# EAGLE design Adafruit 50pin to 40pin TFT with AR1100 Adapter (EAGLE 6.3)
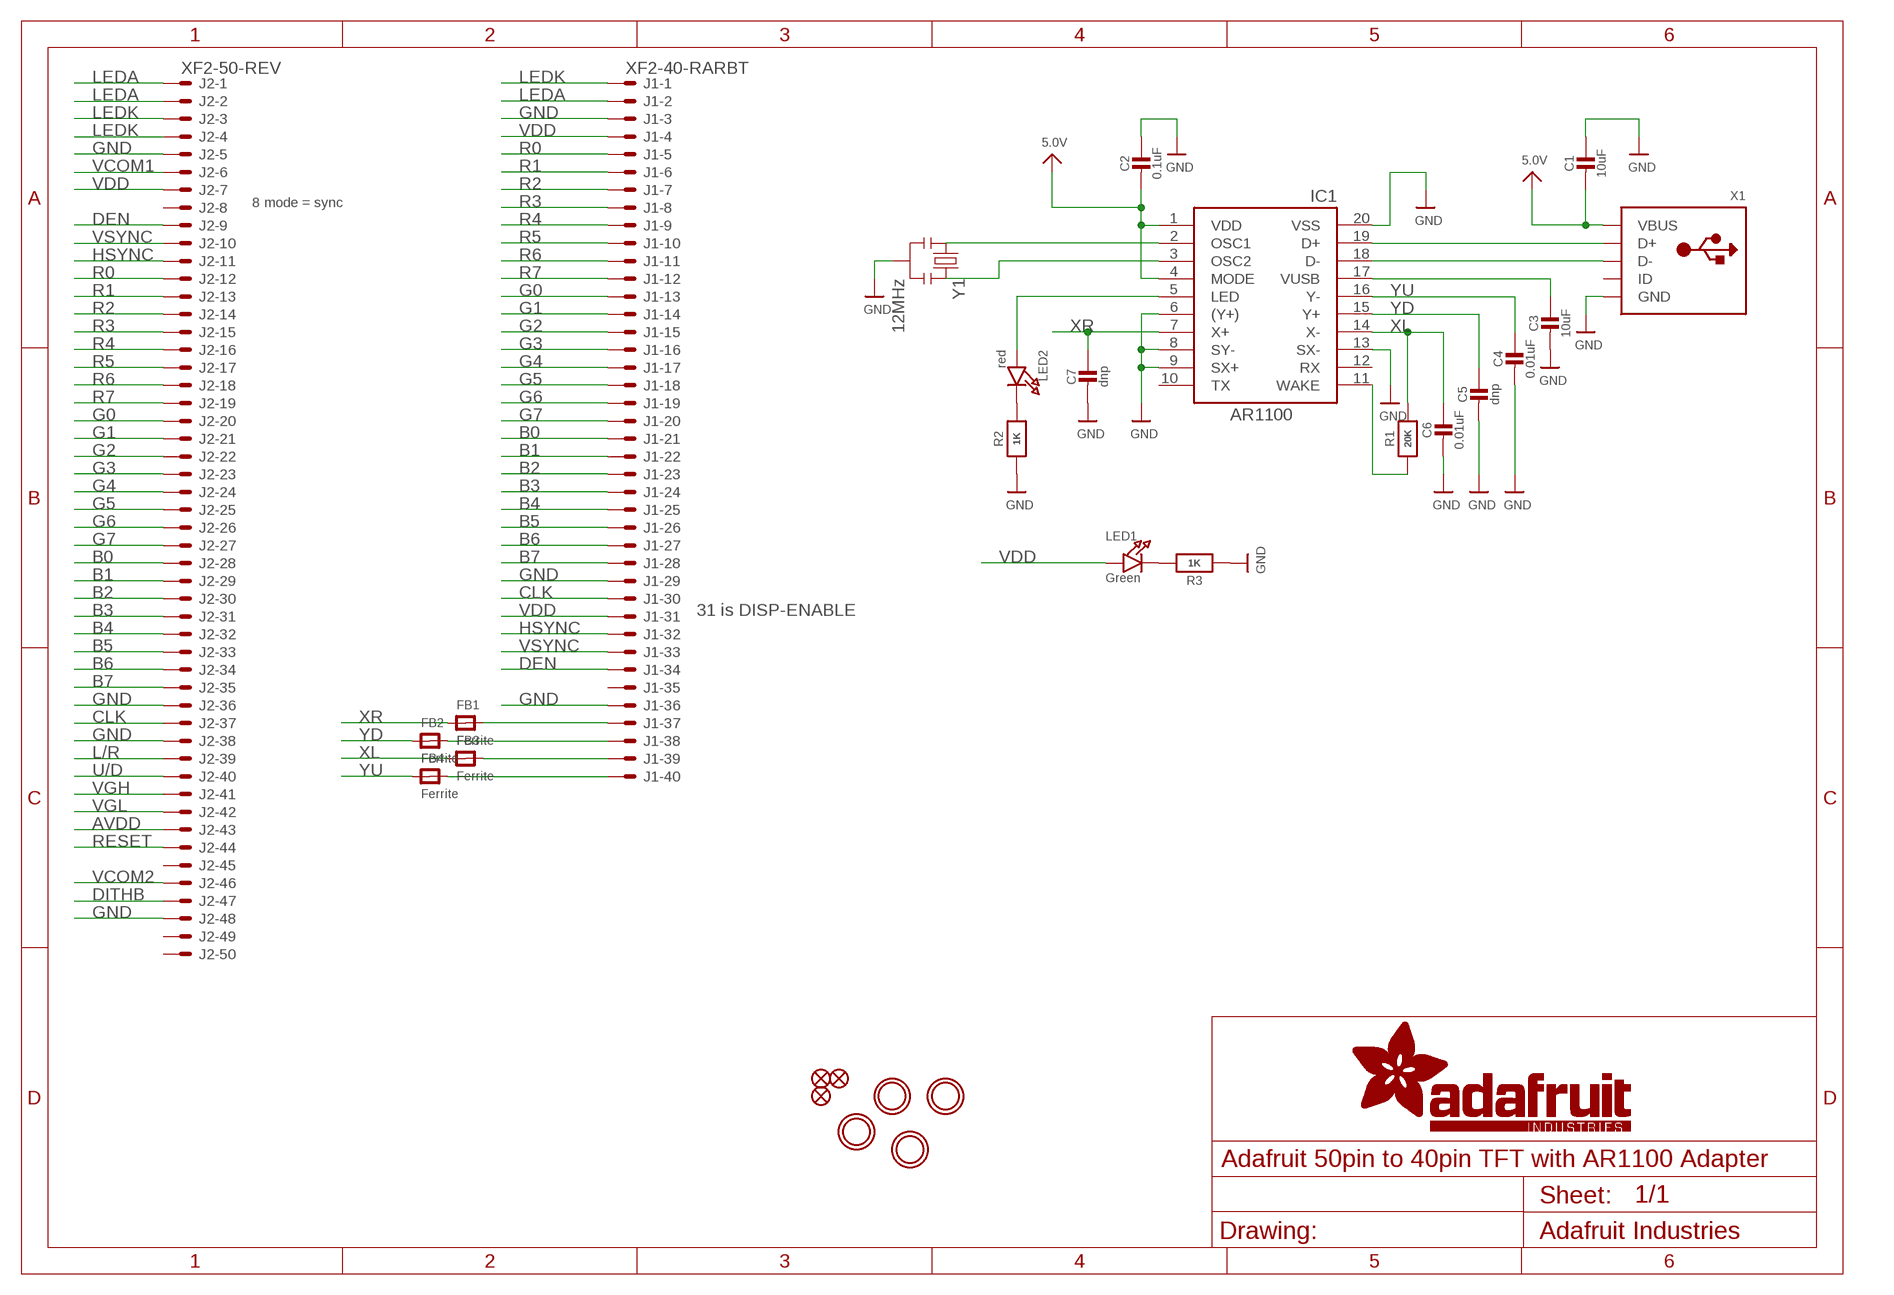
[diagram p0: schematic, sheet 1]

## Parts
C1  10uF  CAP_CERAMIC_0805MP  [_0805MP]
C2  0.1uF  CAP_CERAMIC_0805MP  [_0805MP]
C3  10uF  CAP_CERAMIC_0805MP  [_0805MP]
C4  0.01uF  CAP_CERAMIC_0805MP  [_0805MP]
C5  dnp  CAP_CERAMIC_0805MP  [_0805MP]
C6  0.01uF  CAP_CERAMIC_0805MP  [_0805MP]
C7  dnp  CAP_CERAMIC_0805MP  [_0805MP]
FB1  Ferrite  FERRITE_0805  [_0805]
FB2  Ferrite  FERRITE_0805  [_0805]
FB3  Ferrite  FERRITE_0805  [_0805]
FB4  Ferrite  FERRITE_0805  [_0805]
FID1  FIDUCIAL""  [FIDUCIAL_1MM]
FID2  FIDUCIAL""  [FIDUCIAL_1MM]
FID3  FIDUCIAL""  [FIDUCIAL_1MM]
IC1  AR1100_SSOP  [TSSOP20-5.3MMBODY]
J1  XF2-40-RARBT  [4-1734839-0]
J2  XF2-50-REV  [5-1734839-0-REV]
LED1  Green  LED0805_NOOUTLINE  [CHIPLED_0805_NOOUTLINE]
LED2  red  LED0805_NOOUTLINE  [CHIPLED_0805_NOOUTLINE]
R1  20K  RESISTOR_0805MP  [_0805MP]
R2  1K  RESISTOR_0805MP  [_0805MP]
R3  1K  RESISTOR_0805MP  [_0805MP]
U$11  MOUNTINGHOLE2.5  [MOUNTINGHOLE_2.5_PLATED]
U$14  MOUNTINGHOLE2.5  [MOUNTINGHOLE_2.5_PLATED]
U$15  MOUNTINGHOLE2.5  [MOUNTINGHOLE_2.5_PLATED]
U$16  MOUNTINGHOLE2.5  [MOUNTINGHOLE_2.5_PLATED]
X1  USBMINIBLARGE  [USB-MINIB_LARGER]
Y1  12MHz  RESONATORSMD  [RESONATOR-SMD]

## Nets
5.0V: C1.2 C2.2 IC1.1(VDD) IC1.4(MODE) X1.VBUS
AVDD: J2.43
B0: J1.21 J2.28
B1: J1.22 J2.29
B2: J1.23 J2.30
B3: J1.24 J2.31
B4: J1.25 J2.32
B5: J1.26 J2.33
B6: J1.27 J2.34
B7: J1.28 J2.35
CLK: J1.30 J2.37
D+: IC1.19(D+) X1.D+
D-: IC1.18(D-) X1.D-
DEN: J1.34 J2.9
DITHB: J2.47
G0: J1.13 J2.20
G1: J1.14 J2.21
G2: J1.15 J2.22
G3: J1.16 J2.23
G4: J1.17 J2.24
G5: J1.18 J2.25
G6: J1.19 J2.26
G7: J1.20 J2.27
GND: C1.1 C2.1 C3.2 C4.2 C5.2 C6.2 C7.2 IC1.6((Y+)) IC1.8(SY-) IC1.9(SX+) IC1.13(SX-) IC1.20(VSS) J1.3 J1.29 J1.36 J2.5 J2.36 J2.38 J2.48 R2.1 R3.1 X1.GND X1.GND1(GND) X1.GND2(GND) X1.GND3(GND) X1.GND4(GND) Y1.2
HSYNC: J1.32 J2.11
L/R: J2.39
LEDA: J1.2 J2.1 J2.2
LEDK: J1.1 J2.3 J2.4
N$1: IC1.2(OSC1) Y1.1
N$2: IC1.3(OSC2) Y1.3
N$3: FB1.2 J1.37
N$4: FB2.2 J1.38
N$5: FB3.2 J1.39
N$6: FB4.2 J1.40
N$7: LED2.C R2.2
N$8: IC1.5(LED) LED2.A
N$9: IC1.11(WAKE) R1.1
N$10: LED1.C R3.2
N$13: C3.1 IC1.17(VUSB)
R0: J1.5 J2.12
R1: J1.6 J2.13
R2: J1.7 J2.14
R3: J1.8 J2.15
R4: J1.9 J2.16
R5: J1.10 J2.17
R6: J1.11 J2.18
R7: J1.12 J2.19
RESET: J2.44
U/D: J2.40
VCOM1: J2.6
VCOM2: J2.46
VDD: J1.4 J1.31 J2.7 LED1.A
VGH: J2.41
VGL: J2.42
VSYNC: J1.33 J2.10
XL: C6.1 FB3.1 IC1.14(X-) R1.2
XR: C7.1 FB1.1 IC1.7(X+)
YD: C5.1 FB2.1 IC1.15(Y+)
YU: C4.1 FB4.1 IC1.16(Y-)
Unconnected: IC1.10(TX) IC1.12(RX) J1.35 J2.8 J2.45 J2.49 J2.50 X1.ID

## Notes on the sheet
- 8 mode = sync
- 31 is DISP-ENABLE

## Library data of the parts
C1-C7 = microbuilder:CAP_CERAMIC: Ceramic Capacitors For new designs, use the packages preceded by an '_' character since they are more reliable: The following footprints should be used on most boards: _0402 - Standard footprint for regular board layouts _0603 - Standard footprint for regular board layouts _0805 - Standard footprint for regular board layouts _1206 - Standard footprint for regular board layouts For extremely tight-pitch boards where space is at a premium, the following 'micro-pitch' footprints can be used (smaller pads, no silkscreen outline, etc.): _0402MP - Micro-pitch footprint for very dense/compact boards _0603MP - Micro-pitch footprint for very dense/compact boards _0805MP - Micro-pitch footprint for very dense/compact boards _1206MP - Micro-pitch footprint for very dense/compact boards
FB1-FB4 = microbuilder:FERRITE: Ferrite Bead 0603 MMZ1608B121C - 120 Ohm @ 100MHz, 600mA, 0.15 Ohm DC Resistance - Digikey: 445-2164-1-ND BK1608HW121-T - 120 Ohm, 600mA Ferrite Chip - Digikey: 587-1876-2-ND 0805 HZ0805B272R-10 - 2.7K Ohm @ 100MHz, 200mA, 0.8 Ohm DC Resistance - Digikey: 240-2504-1-ND (see also Murata BLM21BD272SN1L) MMZ2012Y152B - 1.5K Ohm @ 100MHz, 500mA, 0.4 Ohm DC Resistance - Digikey: 445-1560-1-ND - Mainly for high frequency (80-400MHz) MMZ2012R102A - 1K Ohm @ 100MHz, 500mA, 0.3 Ohm DC Resistance - Digikey: 445-1555-2-ND - More general purpose (10-200MHz)
FID1-FID3 = microbuilder:FIDUCIAL: Fiducial Alignment Points Various fiducial points for machine vision alignment.; BOM: EXCLUDE
IC1 = microbuilder:AR1100
J1 = adafruit:XF2*-40?: OMRON FPC Connector Source : http://www.omron.com/ecb/products/pdf/fpc.pdf XF2M-4015-rev is good for connecting up 'PSP' SHARP LQ043 LCDs
J2 = adafruit:XF2*-50?
LED1 LED2 = microbuilder:LED: LED 0603 - 0603 Surface Mount Package 2mA: Green LED - Low Power (3.9mcd, 2ma, 1.7Vf) - Digikey: 475-2709-2-ND Orange LED - Low Power (9.8mcd, 2ma, 1.8Vf) - Digikey: 475-1194-2-ND Red LED - Low Power (5mcd, 2ma, 1.8Vf) - Digikey: 475-1195-2-ND Yellow LED - Low Power (7mcd, 2ma, 1.8Vf) - Digikey: 475-1196-2-ND 5mA: Blue LED - Low Power (17mcd, 5ma, 2.9Vf) - Digikey: LNJ937W8CRACT-ND 0805 - 0805 Surface Mount Package 2mA: Red LED (8.8mcd, 2mA, 1.8Vf, Clear) - Low Power [Digikey: 475-2510-1-ND] Green LED (5mcd, 2mA, 1.8Vf, Clear) - Low Power [Digikey: 475-2730-1-ND] Yellow LED (11.3mcd, 2mA, 1.8Vf, Clear) - Low Power [Digikey: 475-2555-1-ND] 20mA: Red LED (104mcd, 20mA, Diffused) - LS R976 [Digikey: 475-1278-6-ND] Red LED (12mcd, 20mA, 2.0Vf, Clear) - APT2012EC [Digikey: 754-1128-1-ND] Green LED (15mcd, 20mA, 2.2Vf, Clear) - APT2012GC [Digikey: 754-1131-1-ND] Orange LED (160mcd, 20mA, 2.1Vf, Clear) - APT2012SECK [Digikey: 754-1130-1-ND] 1206 - 1206 Surface Mount Package Green LED (26mcd, 20mA, Diffused) - LG N971 [Digikey: 475-1407-6-ND] Red LED (15mcd, 20mA, Diffused) - LH N974 [Digikey: 475-1416-6-ND] Cree - Cree High-Power Surface Mount LEDs XPEBWT-L1-0000-00D50 - White 111lm 350mA 2.9Vf 6200K 110° XTEAWT-00-0000-00000LEE3 - White 114lm 350mA 2.85Vf 5000K 115° Everlight - Everlight 45-21 Series Surface Mount LEDs 45-21/QK2C-B2832AC2CB2/2T - Warm White 2000mcd 20mA 3.25Vf 3050K 120° 45-21/LK2C-B38452C4CB2/2T - Nuetral White 2000mcd 20mA 3.25Vf 4150K 120° 45-21/LK2C-B50634C6CB2/2T - Cold White 2200mcd 20mA 3.25Vf 5650K 120° PLCC2 Reverse Mount LS T77K-J1L2-1-0-2-R18-Z - Red 11.25mcd 2mA 1.8Vf 630nm 120° LO T77K-L1M2-24-Z - Orange 19.6mcd 2mA 1.8Vf 606nm 120° LY T77K-K2M1-26-Z - Yellow 15.7mcd 2mA 1.8Vf 587nm 120°
R1-R3 = microbuilder:RESISTOR: Resistors For new designs, use the packages preceded by an '_' character since they are more reliable: The following footprints should be used on most boards: _0402 - Standard footprint for regular board layouts _0603 - Standard footprint for regular board layouts _0805 - Standard footprint for regular board layouts _1206 - Standard footprint for regular board layouts For extremely tight-pitch boards where space is at a premium, the following 'micro-pitch' footprints can be used (smaller pads, no silkscreen outline, etc.): _0402MP - Micro-pitch footprint for very dense/compact boards _0603MP - Micro-pitch footprint for very dense/compact boards _0805MP - Micro-pitch footprint for very dense/compact boards _1206MP - Micro-pitch footprint for very dense/compact boards
U$11 U$14-U$16 = microbuilder:MOUNTINGHOLE: Mounting Hole For #2 screws (0.086"/2.18mm width, 0.094"/2.4mm hole) use 2.5mm; BOM: EXCLUDE
X1 = microbuilder:USB: USB Connectors USBMINIB - Surface Mount Female Mini-B USB Connector 4UConnector: 06564
Y1 = SparkFun:RESONATOR: Resonator Small SMD resonator. This is the itty bitty 10/20MHz resonators with built in caps. CSTCE10M0G55 and CSTCE20M0V53. Footprint has been reviewed closely but hasn't been tested yet.

## Board
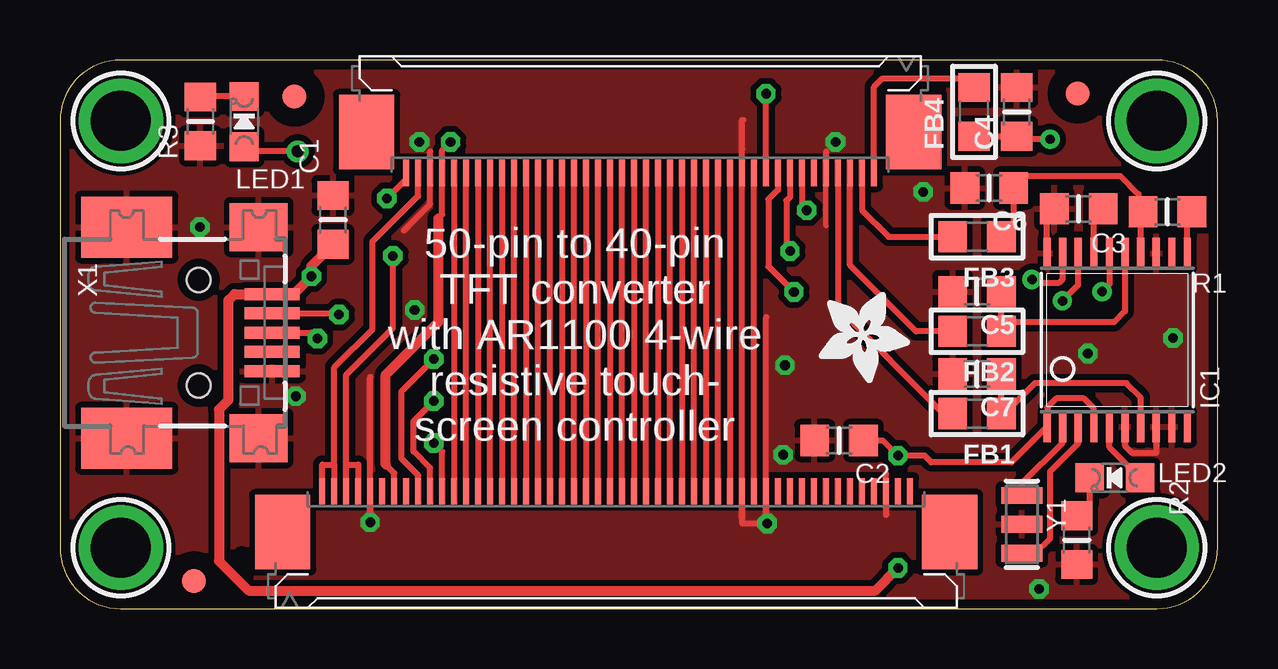
[diagram p1: board, top side]
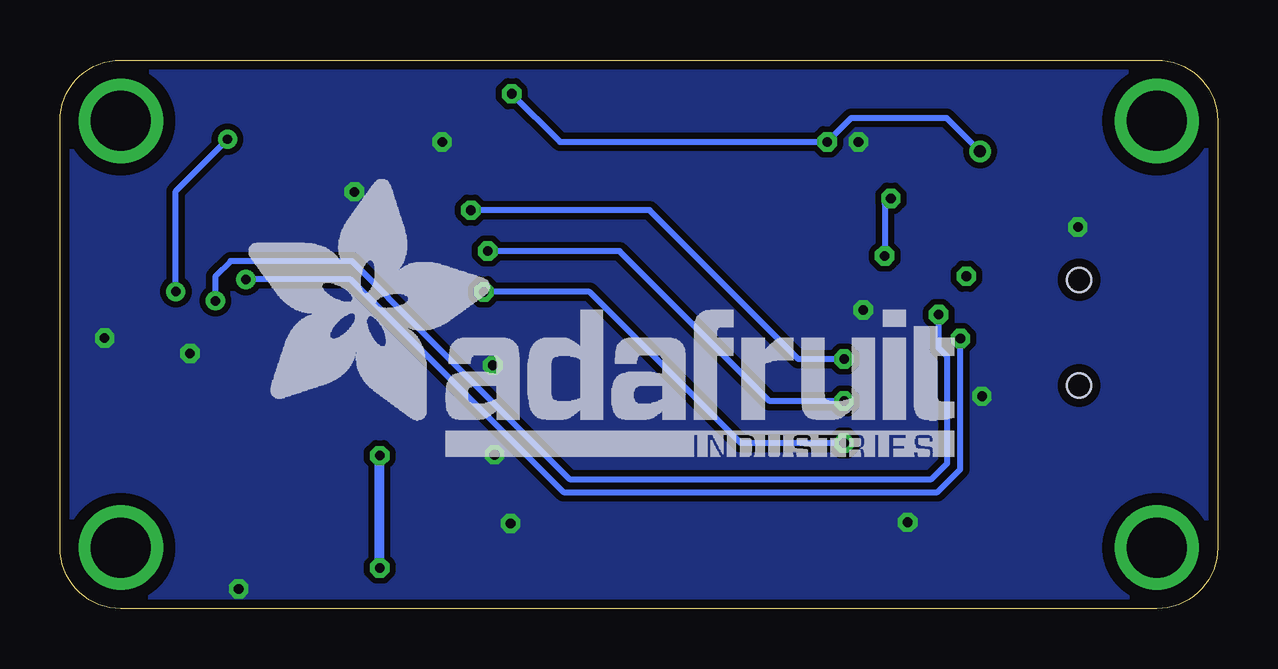
[diagram p2: board, bottom side, seen from below]

Size 48.26 x 22.86 mm. Coordinates in mm from the lower left corner, seen from the top.
Outline: 2.54,0 45.72,0 arc90 48.26,2.54 48.26,20.32 arc90 45.72,22.86 2.54,22.86 arc90 0,20.32 0,2.54 arc90 2.54,0
Copper layers (1*16): Top 0.035mm / dielectric 1.5mm / Bottom 0.035mm
Design rules "adafruit *": minimum track width 8mil, minimum drill 15.5mil, track to track 8mil, track to pad 8mil, pad to pad 8mil, via to via 8mil, smd to smd 8mil, copper to edge 15mil, drill to drill 8mil, minimum pad ring 10mil, minimum via ring 8mil, stop-mask expansion 4mil, vias tented up to drill 20mil, thermal gap 10mil
tRestrict: area 7.5,2.1 to 7.6,2.3

### Footprints (pad centres in the part's own frame; a part is rotated, then mirrored left to right if it is on the bottom)
_0805MP = smd 1.2 x 1.3: 1 -1.016,0; 2 1.016,0
_0805 = smd 1.2 x 1.3: 1 -1.016,0; 2 1.016,0
FIDUCIAL_1MM = smd 1 x 1: 1 0,0
TSSOP20-5.3MMBODY = smd 0.305 x 1.27: 1 -2.925,-3.618; 2 -2.275,-3.618; 3 -1.625,-3.618; 4 -0.975,-3.618; 5 -0.325,-3.618; 6 0.325,-3.618; 7 0.975,-3.618; 8 1.625,-3.618; 9 2.275,-3.618; 10 2.925,-3.618; 11 2.925,3.618; 12 2.275,3.618; 13 1.625,3.618; 14 0.975,3.618; 15 0.325,3.618; 16 -0.325,3.618; 17 -0.975,3.618; 18 -1.625,3.618; 19 -2.275,3.618; 20 -2.925,3.618
4-1734839-0 = smd 0.25 x 1.1: 1 -9.75,-2.54; 2 -9.25,-2.54; 3 -8.75,-2.54; 4 -8.25,-2.54; 5 -7.75,-2.54; 6 -7.25,-2.54; 7 -6.75,-2.54; 8 -6.25,-2.54; 9 -5.75,-2.54; 10 -5.25,-2.54; 11 -4.75,-2.54; 12 -4.25,-2.54; 13 -3.75,-2.54; 14 -3.25,-2.54; 15 -2.75,-2.54; 16 -2.25,-2.54; 17 -1.75,-2.54; 18 -1.25,-2.54; 19 -0.75,-2.54; 20 -0.25,-2.54; 21 0.25,-2.54; 22 0.75,-2.54; 23 1.25,-2.54; 24 1.75,-2.54; 25 2.25,-2.54; 26 2.75,-2.54; 27 3.25,-2.54; 28 3.75,-2.54; 29 4.25,-2.54; 30 4.75,-2.54; 31 5.25,-2.54; 32 5.75,-2.54; 33 6.25,-2.54; 34 6.75,-2.54; 35 7.25,-2.54; 36 7.75,-2.54; 37 8.25,-2.54; 38 8.75,-2.54; 39 9.25,-2.54; 40 9.75,-2.54 | smd 2.3 x 3.1: M1 11.4,-0.84; M2 -11.4,-0.84
5-1734839-0-REV = smd 0.25 x 1.1: 1 12.25,-2.54; 2 11.75,-2.54; 3 11.25,-2.54; 4 10.75,-2.54; 5 10.25,-2.54; 6 9.75,-2.54; 7 9.25,-2.54; 8 8.75,-2.54; 9 8.25,-2.54; 10 7.75,-2.54; 11 7.25,-2.54; 12 6.75,-2.54; 13 6.25,-2.54; 14 5.75,-2.54; 15 5.25,-2.54; 16 4.75,-2.54; 17 4.25,-2.54; 18 3.75,-2.54; 19 3.25,-2.54; 20 2.75,-2.54; 21 2.25,-2.54; 22 1.75,-2.54; 23 1.25,-2.54; 24 0.75,-2.54; 25 0.25,-2.54; 26 -0.25,-2.54; 27 -0.75,-2.54; 28 -1.25,-2.54; 29 -1.75,-2.54; 30 -2.25,-2.54; 31 -2.75,-2.54; 32 -3.25,-2.54; 33 -3.75,-2.54; 34 -4.25,-2.54; 35 -4.75,-2.54; 36 -5.25,-2.54; 37 -5.75,-2.54; 38 -6.25,-2.54; 39 -6.75,-2.54; 40 -7.25,-2.54; 41 -7.75,-2.54; 42 -8.25,-2.54; 43 -8.75,-2.54; 44 -9.25,-2.54; 45 -9.75,-2.54; 46 -10.25,-2.54; 47 -10.75,-2.54; 48 -11.25,-2.54; 49 -11.75,-2.54; 50 -12.25,-2.54 | smd 2.3 x 3.1: M1 13.9,-0.84; M2 -13.9,-0.84
CHIPLED_0805_NOOUTLINE = smd 1.2 x 1.2: A 0,-1.05; C 0,1.05
MOUNTINGHOLE_2.5_PLATED = drill 2.5 pad 3.2: P$1 0,0
USB-MINIB_LARGER = smd 0.5 x 2.308: D+ 0,4.064; D- -0.8,4.064; GND 1.6,4.064; ID 0.8,4.064; VBUS -1.6,4.064 | smd 2.54 x 3.81: GND1 -4.4,-2; GND4 4.4,-2 | smd 2 x 2.4: GND2 -4.4,3.5; GND3 4.4,3.5 | hole 1: -2.2,1; 2.2,1
RESONATOR-SMD = smd 0.7 x 1.7: 1 -1.2,0; 2 0,0; 3 1.2,0

### Placement (x,y rotation side)
C1  11.38,16.2 270 top
C2  32.47,7.01 0 top
C3  42.46,16.66 180 top
C4  39.88,20.7 90 top
C5  38.23,13.21 180 top
C6  38.73,17.53 180 top
C7  38.23,9.78 180 top
FB1  38.23,8.13 180 top
FB2  38.23,11.56 180 top
FB3  38.23,15.49 180 top
FB4  38.1,20.7 90 top
FID1  5.59,1.14 90 top
FID2  42.42,21.46 90 top
FID3  9.78,21.34 90 top
IC1  44.07,11.2 0 top
J1  24.18,20.7 0 top
J2  23.18,2.35 180 top
LED1  7.68,20.29 0 top
LED2  43.97,5.45 90 top
R1  46.16,16.53 180 top
R2  42.38,2.86 90 top
R3  5.85,20.3 90 top
U$11  45.72,2.54 90 top
U$14  45.72,20.32 90 top
U$15  2.54,20.32 90 top
U$16  2.54,2.54 90 top
U$18  [ADAFRUIT_TEXT_30MM]  40.64,6.35 0 bottom
U$19  [ADAFRUIT_3.5MM]  31.62,13.21 270 top
X1  4.78,11.5 270 top
Y1  40.09,3.51 270 top

### Tracks (layer width: path | path; a pad name or v marks a point on that pad's centre or on a via)
5.0V  (via drill 0.4)
  Top 0.254: C2.2 34.3,7.01 v34.93,6.37 36.05,6.37 36.32,6.1 39.66,6.1 IC1.1 41.15,8.38 41.53,8.76 42.67,8.76 43.09,8.34 IC1.4
  Top 0.406: C1.2 10.48,14.28 v10.48,13.85 9.73,13.1 X1.VBUS 7.28,13.1 7.03,12.85 7.03,8.7 6.63,8.3 6.63,1.99 7.87,0.75 33.98,0.75 v34.93,1.7
  Bottom 0.406: v34.93,1.7 v34.93,6.37
B0
  Top 0.254: J2.28 J1.21
B1
  Top 0.254: J1.22 J2.29
B2
  Top 0.254: J2.30 J1.23
B3
  Top 0.254: J1.24 J2.31
B4
  Top 0.254: J2.32 J1.25
B5
  Top 0.254: J1.26 J2.33
B6
  Top 0.254: J2.34 J1.27
B7
  Top 0.254: J1.28 J2.35
CLK
  Top 0.254: J2.37 J1.30
D+  (via drill 0.39, 0.4)
  Top 0.254: X1.D+ 10.48,11.5 v10.73,11.25 | v40.51,13.72 40.64,13.59 41.66,13.59 41.79,13.73 IC1.19
  Bottom 0.254: v10.73,11.25 10.73,5.8 11.68,4.85 27.28,4.85 36.15,13.72 v40.51,13.72
D-  (via drill 0.39, 0.4)
  Top 0.254: X1.D- 11.63,12.3 v11.63,12.25 | v41.78,12.83 42.44,13.49 IC1.18
  Bottom 0.254: v11.63,12.25 11.63,10.85 11.28,10.5 11.28,6.05 11.93,5.4 27.03,5.4 34.58,12.95 34.58,12.97 36.09,14.48 41.15,14.48 41.78,13.84 v41.78,12.83
DEN  (via drill 0.4)
  Top 0.254: J2.9 14.93,5.55 14.23,6.25 14.23,9.05 v15.58,10.4 | J1.34 30.93,16.8 v31.13,16.6
  Bottom 0.254: v15.58,10.4 17.48,10.4 23.68,16.6 v31.13,16.6
G0
  Top 0.254: J2.20 J1.13
G1
  Top 0.254: J1.14 J2.21
G2
  Top 0.254: J2.22 J1.15
G3
  Top 0.254: J1.16 J2.23
G4
  Top 0.254: J2.24 J1.17
G5
  Top 0.254: J1.18 J2.25
G6
  Top 0.254: J2.26 J1.19
G7
  Top 0.254: J1.20 J2.27
GND  (via drill 0.4)
  Top 0.203: 31.93,15.95 J1.36
  Top 0.254: 29.43,3.85 J2.38 | J2.38 29.43,12.15 | 28.43,3.75 J2.36 | J2.36 J1.29 | J1.29 28.43,19.15 | 12.93,4 J2.5 | J2.5 12.93,9.65 | 14.33,15.75 15.43,16.85 J1.3 15.43,19.05 | 34.43,3.9 J2.48 34.43,5.6 | J2.36 28.43,3.55 v29.48,3.55 29.43,3.55 J2.38 | J1.29 28.43,20.35 28.48,20.35 | J2.5 v12.93,3.6 | 31.93,19.05 J1.36 | IC1.20 41.14,16.35 C3.2 | IC1.6 44.39,6.79 44.7,6.48 45.69,6.48 IC1.8
  other vias: 32.33,19.45 14.98,19.45 14.78,12.45 9.83,8.85 5.83,15.9 46.4,11.27 40.81,0.82 30.14,6.41 30.22,10.14 42.84,10.64 35.98,17.37
  pour Top (isolate 0.254): 48.26,0 0.18,0 0.18,23 48.26,23
  pour Bottom (isolate 0.254): 48.26,0 0.18,0 0.18,23 48.26,23
HSYNC  (via drill 0.4)
  Top 0.254: J2.11 15.93,6.55 v15.58,6.9 | J1.32 29.93,17.45 29.53,17.05 29.53,14.26 v30.59,13.2
  Bottom 0.254: v15.58,6.9 19.88,6.9 26.18,13.2 v30.59,13.2
LEDA
  Top 0.254: J2.1 10.93,6 11.43,6 | 11.43,6 J2.2 | J1.2 14.93,17.2 13.03,15.3 13.03,11.65 11.43,10.05 11.43,6
LEDK  (via drill 0.4)
  Top 0.254: J2.3 11.93,6 | 11.93,6 12.43,6 J2.4 | J1.1 14.43,17.9 v13.63,17.1 | 11.93,6 11.93,9.75 13.88,11.7 v13.88,14.7
  Bottom 0.254: v13.88,14.7 13.88,16.85 v13.64,17.1 v13.63,17.1
N$1
  Top 0.254: IC1.2 41.79,6.92 40.09,5.22 Y1.1
N$2
  Top 0.254: Y1.3 40.67,2.31 41.27,2.92 41.27,5.71 42.44,6.88 IC1.3
N$3
  Top 0.254: J1.37 32.43,12.53 36.83,8.13 FB1.2
N$4
  Top 0.254: FB2.2 35.69,11.56 32.93,14.31 J1.38
N$5
  Top 0.254: J1.39 33.43,16.61 34.54,15.49 FB3.2
N$6
  Top 0.254: J1.40 33.93,21.74 34.29,22.1 37.72,22.1 FB4.2
N$7
  Top 0.254: R2.2 42.92,4.41 LED2.C
N$8
  Top 0.254: LED2.A 43.74,6.73 IC1.5
N$9
  Top 0.254: 47.18,16.77 R1.1 46.99,16.34 IC1.11
N$10
  Top 0.254: LED1.C 5.87,21.34 R3.2
N$13
  Top 0.254: IC1.17 43.09,16.27 C3.1
R0
  Top 0.254: J1.5 J2.12
R1
  Top 0.254: J2.13 J1.6
R2
  Top 0.254: J1.7 J2.14
R3
  Top 0.254: J2.15 J1.8
R4
  Top 0.254: J1.9 J2.16
R5
  Top 0.254: J2.17 J1.10
R6
  Top 0.254: J1.11 J2.18
R7
  Top 0.254: J2.19 J1.12
VDD  (via drill 0.4, 0.5)
  Top 0.254: J2.7 13.93,5.65 13.58,6 | v16.28,19.45 15.93,19.1 J1.4 15.93,16.42 15.78,16.27 15.78,16.25 | J1.31 v29.43,21.45 | v9.91,19.05 7.87,19.05 LED1.A
  Top 0.406: 13.58,6 13.58,9.75 15.78,11.95 15.78,16.25
  Bottom 0.254: v29.43,21.45 27.43,19.45 v16.28,19.45 15.28,20.45 11.31,20.45 v9.91,19.05
VSYNC  (via drill 0.4)
  Top 0.254: J2.10 15.43,5.85 14.73,6.55 14.73,7.8 v15.58,8.65 | J1.33 30.43,17.15 30.28,17 30.28,15.1 30.43,14.95 v30.43,14.9
  Bottom 0.254: v15.58,8.65 18.68,8.65 24.93,14.9 v30.43,14.9
XL
  Top 0.254: FB3.1 39.75,16 C6.1 40.26,18.03 44.2,18.03 44.96,17.27 44.96,16.72 R1.2 45.04,16.43 IC1.14
XR
  Top 0.254: C7.1 FB1.1 39.37,8.13 40.64,9.4 44.45,9.4 45.04,8.8 IC1.7
YD
  Top 0.254: C5.1 FB2.1 39.62,11.94 43.94,11.94 44.39,12.39 IC1.15
YU  (via drill 0.39)
  Top 0.254: FB4.1 C4.1 40.01,19.56 v41.27,19.56 | IC1.16 43.74,13.52 v43.43,13.21
  Bottom 0.254: v43.43,13.21 43.43,17.4 v41.27,19.56

### Text on the board
tPlace: 50-pin to 40-pin / TFT converter / with AR1100 4-wire / resistive touch- / screen controller